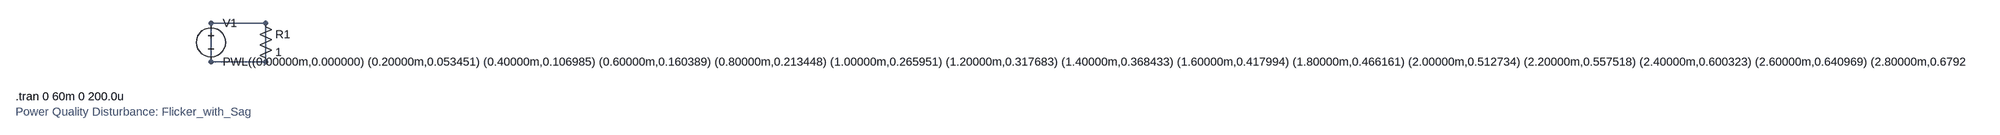
[diagram p0: schematic Flicker_with_Sag.asc]
Flicker_with_Sag.asc, the LTspice schematic file:
Version 4
SHEET 1 880 680
WIRE 192 128 80 128
WIRE 80 128 80 208
WIRE 192 208 80 208
WIRE 192 128 192 208
SYMBOL voltage 80 112 R0
WINDOW 123 0 0 Left 0
WINDOW 39 0 0 Left 0
SYMATTR InstName V1
SYMATTR Value PWL((0.00000m,0.000000) (0.20000m,0.053451) (0.40000m,0.106985) (0.60000m,0.160389) (0.80000m,0.213448) (1.00000m,0.265951) (1.20000m,0.317683) (1.40000m,0.368433) (1.60000m,0.417994) (1.80000m,0.466161) (2.00000m,0.512734) (2.20000m,0.557518) (2.40000m,0.600323) (2.60000m,0.640969) (2.80000m,0.679281) (3.00000m,0.715093) (3.20000m,0.748248) (3.40000m,0.778601) (3.60000m,0.806014) (3.80000m,0.830362) (4.00000m,0.851532) (4.20000m,0.869422) (4.40000m,0.883945) (4.60000m,0.895025) (4.80000m,0.902599) (5.00000m,0.906620) (5.20000m,0.907054) (5.40000m,0.903881) (5.60000m,0.897097) (5.80000m,0.886710) (6.00000m,0.872746) (6.20000m,0.855242) (6.40000m,0.834251) (6.60000m,0.809843) (6.80000m,0.782098) (7.00000m,0.751113) (7.20000m,0.716996) (7.40000m,0.679871) (7.60000m,0.639873) (7.80000m,0.597149) (8.00000m,0.551860) (8.20000m,0.504175) (8.40000m,0.454277) (8.60000m,0.402355) (8.80000m,0.348610) (9.00000m,0.293251) (9.20000m,0.236492) (9.40000m,0.178558) (9.60000m,0.119675) (9.80000m,0.060076) (10.00000m,0.000000) (10.20000m,-0.060315) (10.40000m,-0.120626) (10.60000m,-0.180692) (10.80000m,-0.240268) (11.00000m,-0.299114) (11.20000m,-0.356990) (11.40000m,-0.413658) (11.60000m,-0.468887) (11.80000m,-0.522449) (12.00000m,-0.574122) (12.20000m,-0.623690) (12.40000m,-0.670949) (12.60000m,-0.715697) (12.80000m,-0.757748) (13.00000m,-0.796922) (13.20000m,-0.833053) (13.40000m,-0.865984) (13.60000m,-0.895572) (13.80000m,-0.921689) (14.00000m,-0.944218) (14.20000m,-0.963056) (14.40000m,-0.978118) (14.60000m,-0.989330) (14.80000m,-0.996638) (15.00000m,-1.000000) (15.20000m,-0.999392) (15.40000m,-0.994804) (15.60000m,-0.986246) (15.80000m,-0.973741) (16.00000m,-0.957328) (16.20000m,-0.937066) (16.40000m,-0.913024) (16.60000m,-0.885293) (16.80000m,-0.853973) (17.00000m,-0.819184) (17.20000m,-0.781057) (17.40000m,-0.739740) (17.60000m,-0.695392) (17.80000m,-0.648184) (18.00000m,-0.598303) (18.20000m,-0.545943) (18.40000m,-0.491311) (18.60000m,-0.434623) (18.80000m,-0.376104) (19.00000m,-0.315986) (19.20000m,-0.254510) (19.40000m,-0.191921) (19.60000m,-0.128469) (19.80000m,-0.064410) (20.00000m,-0.000000) (20.20000m,0.032250) (20.40000m,0.064416) (20.60000m,0.096368) (20.80000m,0.127976) (21.00000m,0.159113) (21.20000m,0.189652) (21.40000m,0.219470) (21.60000m,0.248446) (21.80000m,0.276461) (22.00000m,0.303403) (22.20000m,0.329161) (22.40000m,0.353631) (22.60000m,0.376712) (22.80000m,0.398312) (23.00000m,0.418341) (23.20000m,0.436718) (23.40000m,0.453368) (23.60000m,0.468224) (23.80000m,0.481223) (24.00000m,0.492314) (24.20000m,0.501451) (24.40000m,0.508597) (24.60000m,0.513721) (24.80000m,0.516805) (25.00000m,0.517834) (25.20000m,0.516805) (25.40000m,0.513721) (25.60000m,0.508597) (25.80000m,0.501451) (26.00000m,0.492314) (26.20000m,0.481223) (26.40000m,0.468224) (26.60000m,0.453368) (26.80000m,0.436718) (27.00000m,0.418341) (27.20000m,0.398312) (27.40000m,0.376712) (27.60000m,0.353631) (27.80000m,0.329161) (28.00000m,0.303403) (28.20000m,0.276461) (28.40000m,0.248446) (28.60000m,0.219470) (28.80000m,0.189652) (29.00000m,0.159113) (29.20000m,0.127976) (29.40000m,0.096368) (29.60000m,0.064416) (29.80000m,0.032250) (30.00000m,0.000000) (30.20000m,-0.032205) (30.40000m,-0.064235) (30.60000m,-0.095960) (30.80000m,-0.127255) (31.00000m,-0.157993) (31.20000m,-0.188052) (31.40000m,-0.217311) (31.60000m,-0.245655) (31.80000m,-0.272971) (32.00000m,-0.299151) (32.20000m,-0.324092) (32.40000m,-0.347696) (32.60000m,-0.369870) (32.80000m,-0.390529) (33.00000m,-0.409592) (33.20000m,-0.426987) (33.40000m,-0.442646) (33.60000m,-0.456512) (33.80000m,-0.468533) (34.00000m,-0.478664) (34.20000m,-0.486870) (34.40000m,-0.493123) (34.60000m,-0.497402) (34.80000m,-0.499696) (35.00000m,-0.500000) (35.20000m,-0.498319) (35.40000m,-0.494665) (35.60000m,-0.489059) (35.80000m,-0.481528) (36.00000m,-0.472109) (36.20000m,-0.460845) (36.40000m,-0.447786) (36.60000m,-0.432992) (36.80000m,-0.416526) (37.00000m,-0.398461) (37.20000m,-0.378874) (37.40000m,-0.357849) (37.60000m,-0.335474) (37.80000m,-0.311845) (38.00000m,-0.287061) (38.20000m,-0.261224) (38.40000m,-0.234444) (38.60000m,-0.206829) (38.80000m,-0.178495) (39.00000m,-0.149557) (39.20000m,-0.120134) (39.40000m,-0.090346) (39.60000m,-0.060313) (39.80000m,-0.030157) (40.00000m,-0.000000) (40.20000m,0.060076) (40.40000m,0.119675) (40.60000m,0.178558) (40.80000m,0.236492) (41.00000m,0.293251) (41.20000m,0.348610) (41.40000m,0.402355) (41.60000m,0.454277) (41.80000m,0.504175) (42.00000m,0.551860) (42.20000m,0.597149) (42.40000m,0.639873) (42.60000m,0.679871) (42.80000m,0.716996) (43.00000m,0.751113) (43.20000m,0.782098) (43.40000m,0.809843) (43.60000m,0.834251) (43.80000m,0.855242) (44.00000m,0.872746) (44.20000m,0.886710) (44.40000m,0.897097) (44.60000m,0.903881) (44.80000m,0.907054) (45.00000m,0.906620) (45.20000m,0.902599) (45.40000m,0.895025) (45.60000m,0.883945) (45.80000m,0.869422) (46.00000m,0.851532) (46.20000m,0.830362) (46.40000m,0.806014) (46.60000m,0.778601) (46.80000m,0.748248) (47.00000m,0.715093) (47.20000m,0.679281) (47.40000m,0.640969) (47.60000m,0.600323) (47.80000m,0.557518) (48.00000m,0.512734) (48.20000m,0.466161) (48.40000m,0.417994) (48.60000m,0.368433) (48.80000m,0.317683) (49.00000m,0.265951) (49.20000m,0.213448) (49.40000m,0.160389) (49.60000m,0.106985) (49.80000m,0.053451) (50.00000m,0.000000) (50.20000m,-0.053156) (50.40000m,-0.105808) (50.60000m,-0.157751) (50.80000m,-0.208781) (51.00000m,-0.258703) (51.20000m,-0.307325) (51.40000m,-0.354462) (51.60000m,-0.399935) (51.80000m,-0.443574) (52.00000m,-0.485217) (52.20000m,-0.524711) (52.40000m,-0.561912) (52.60000m,-0.596686) (52.80000m,-0.628909) (53.00000m,-0.658469) (53.20000m,-0.685265) (53.40000m,-0.709207) (53.60000m,-0.730217) (53.80000m,-0.748228) (54.00000m,-0.763188) (54.20000m,-0.775054) (54.40000m,-0.783798) (54.60000m,-0.789404) (54.80000m,-0.791867) (55.00000m,-0.791196) (55.20000m,-0.787412) (55.40000m,-0.780547) (55.60000m,-0.770646) (55.80000m,-0.757766) (56.00000m,-0.741974) (56.20000m,-0.723348) (56.40000m,-0.701979) (56.60000m,-0.677965) (56.80000m,-0.651415) (57.00000m,-0.622449) (57.20000m,-0.591194) (57.40000m,-0.557784) (57.60000m,-0.522362) (57.80000m,-0.485079) (58.00000m,-0.446091) (58.20000m,-0.405560) (58.40000m,-0.363653) (58.60000m,-0.320540) (58.80000m,-0.276398) (59.00000m,-0.231403) (59.20000m,-0.185737) (59.40000m,-0.139581) (59.60000m,-0.093118) (59.80000m,-0.046530))
SYMBOL res 176 112 R0
SYMATTR InstName R1
SYMATTR Value 1
TEXT -320 280 Left 2 !.tran 0 60m 0 200.0u
TEXT -320 312 Left 2 ;Power Quality Disturbance: Flicker_with_Sag

The netlist it stands for:
* Flicker_with_Sag.asc
V1 N001 N001 PWL((0.00000m,0.000000) (0.20000m,0.053451) (0.40000m,0.106985) (0.60000m,0.160389) (0.80000m,0.213448) (1.00000m,0.265951) (1.20000m,0.317683) (1.40000m,0.368433) (1.60000m,0.417994) (1.80000m,0.466161) (2.00000m,0.512734) (2.20000m,0.557518) (2.40000m,0.600323) (2.60000m,0.640969) (2.80000m,0.679281) (3.00000m,0.715093) (3.20000m,0.748248) (3.40000m,0.778601) (3.60000m,0.806014) (3.80000m,0.830362) (4.00000m,0.851532) (4.20000m,0.869422) (4.40000m,0.883945) (4.60000m,0.895025) (4.80000m,0.902599) (5.00000m,0.906620) (5.20000m,0.907054) (5.40000m,0.903881) (5.60000m,0.897097) (5.80000m,0.886710) (6.00000m,0.872746) (6.20000m,0.855242) (6.40000m,0.834251) (6.60000m,0.809843) (6.80000m,0.782098) (7.00000m,0.751113) (7.20000m,0.716996) (7.40000m,0.679871) (7.60000m,0.639873) (7.80000m,0.597149) (8.00000m,0.551860) (8.20000m,0.504175) (8.40000m,0.454277) (8.60000m,0.402355) (8.80000m,0.348610) (9.00000m,0.293251) (9.20000m,0.236492) (9.40000m,0.178558) (9.60000m,0.119675) (9.80000m,0.060076) (10.00000m,0.000000) (10.20000m,-0.060315) (10.40000m,-0.120626) (10.60000m,-0.180692) (10.80000m,-0.240268) (11.00000m,-0.299114) (11.20000m,-0.356990) (11.40000m,-0.413658) (11.60000m,-0.468887) (11.80000m,-0.522449) (12.00000m,-0.574122) (12.20000m,-0.623690) (12.40000m,-0.670949) (12.60000m,-0.715697) (12.80000m,-0.757748) (13.00000m,-0.796922) (13.20000m,-0.833053) (13.40000m,-0.865984) (13.60000m,-0.895572) (13.80000m,-0.921689) (14.00000m,-0.944218) (14.20000m,-0.963056) (14.40000m,-0.978118) (14.60000m,-0.989330) (14.80000m,-0.996638) (15.00000m,-1.000000) (15.20000m,-0.999392) (15.40000m,-0.994804) (15.60000m,-0.986246) (15.80000m,-0.973741) (16.00000m,-0.957328) (16.20000m,-0.937066) (16.40000m,-0.913024) (16.60000m,-0.885293) (16.80000m,-0.853973) (17.00000m,-0.819184) (17.20000m,-0.781057) (17.40000m,-0.739740) (17.60000m,-0.695392) (17.80000m,-0.648184) (18.00000m,-0.598303) (18.20000m,-0.545943) (18.40000m,-0.491311) (18.60000m,-0.434623) (18.80000m,-0.376104) (19.00000m,-0.315986) (19.20000m,-0.254510) (19.40000m,-0.191921) (19.60000m,-0.128469) (19.80000m,-0.064410) (20.00000m,-0.000000) (20.20000m,0.032250) (20.40000m,0.064416) (20.60000m,0.096368) (20.80000m,0.127976) (21.00000m,0.159113) (21.20000m,0.189652) (21.40000m,0.219470) (21.60000m,0.248446) (21.80000m,0.276461) (22.00000m,0.303403) (22.20000m,0.329161) (22.40000m,0.353631) (22.60000m,0.376712) (22.80000m,0.398312) (23.00000m,0.418341) (23.20000m,0.436718) (23.40000m,0.453368) (23.60000m,0.468224) (23.80000m,0.481223) (24.00000m,0.492314) (24.20000m,0.501451) (24.40000m,0.508597) (24.60000m,0.513721) (24.80000m,0.516805) (25.00000m,0.517834) (25.20000m,0.516805) (25.40000m,0.513721) (25.60000m,0.508597) (25.80000m,0.501451) (26.00000m,0.492314) (26.20000m,0.481223) (26.40000m,0.468224) (26.60000m,0.453368) (26.80000m,0.436718) (27.00000m,0.418341) (27.20000m,0.398312) (27.40000m,0.376712) (27.60000m,0.353631) (27.80000m,0.329161) (28.00000m,0.303403) (28.20000m,0.276461) (28.40000m,0.248446) (28.60000m,0.219470) (28.80000m,0.189652) (29.00000m,0.159113) (29.20000m,0.127976) (29.40000m,0.096368) (29.60000m,0.064416) (29.80000m,0.032250) (30.00000m,0.000000) (30.20000m,-0.032205) (30.40000m,-0.064235) (30.60000m,-0.095960) (30.80000m,-0.127255) (31.00000m,-0.157993) (31.20000m,-0.188052) (31.40000m,-0.217311) (31.60000m,-0.245655) (31.80000m,-0.272971) (32.00000m,-0.299151) (32.20000m,-0.324092) (32.40000m,-0.347696) (32.60000m,-0.369870) (32.80000m,-0.390529) (33.00000m,-0.409592) (33.20000m,-0.426987) (33.40000m,-0.442646) (33.60000m,-0.456512) (33.80000m,-0.468533) (34.00000m,-0.478664) (34.20000m,-0.486870) (34.40000m,-0.493123) (34.60000m,-0.497402) (34.80000m,-0.499696) (35.00000m,-0.500000) (35.20000m,-0.498319) (35.40000m,-0.494665) (35.60000m,-0.489059) (35.80000m,-0.481528) (36.00000m,-0.472109) (36.20000m,-0.460845) (36.40000m,-0.447786) (36.60000m,-0.432992) (36.80000m,-0.416526) (37.00000m,-0.398461) (37.20000m,-0.378874) (37.40000m,-0.357849) (37.60000m,-0.335474) (37.80000m,-0.311845) (38.00000m,-0.287061) (38.20000m,-0.261224) (38.40000m,-0.234444) (38.60000m,-0.206829) (38.80000m,-0.178495) (39.00000m,-0.149557) (39.20000m,-0.120134) (39.40000m,-0.090346) (39.60000m,-0.060313) (39.80000m,-0.030157) (40.00000m,-0.000000) (40.20000m,0.060076) (40.40000m,0.119675) (40.60000m,0.178558) (40.80000m,0.236492) (41.00000m,0.293251) (41.20000m,0.348610) (41.40000m,0.402355) (41.60000m,0.454277) (41.80000m,0.504175) (42.00000m,0.551860) (42.20000m,0.597149) (42.40000m,0.639873) (42.60000m,0.679871) (42.80000m,0.716996) (43.00000m,0.751113) (43.20000m,0.782098) (43.40000m,0.809843) (43.60000m,0.834251) (43.80000m,0.855242) (44.00000m,0.872746) (44.20000m,0.886710) (44.40000m,0.897097) (44.60000m,0.903881) (44.80000m,0.907054) (45.00000m,0.906620) (45.20000m,0.902599) (45.40000m,0.895025) (45.60000m,0.883945) (45.80000m,0.869422) (46.00000m,0.851532) (46.20000m,0.830362) (46.40000m,0.806014) (46.60000m,0.778601) (46.80000m,0.748248) (47.00000m,0.715093) (47.20000m,0.679281) (47.40000m,0.640969) (47.60000m,0.600323) (47.80000m,0.557518) (48.00000m,0.512734) (48.20000m,0.466161) (48.40000m,0.417994) (48.60000m,0.368433) (48.80000m,0.317683) (49.00000m,0.265951) (49.20000m,0.213448) (49.40000m,0.160389) (49.60000m,0.106985) (49.80000m,0.053451) (50.00000m,0.000000) (50.20000m,-0.053156) (50.40000m,-0.105808) (50.60000m,-0.157751) (50.80000m,-0.208781) (51.00000m,-0.258703) (51.20000m,-0.307325) (51.40000m,-0.354462) (51.60000m,-0.399935) (51.80000m,-0.443574) (52.00000m,-0.485217) (52.20000m,-0.524711) (52.40000m,-0.561912) (52.60000m,-0.596686) (52.80000m,-0.628909) (53.00000m,-0.658469) (53.20000m,-0.685265) (53.40000m,-0.709207) (53.60000m,-0.730217) (53.80000m,-0.748228) (54.00000m,-0.763188) (54.20000m,-0.775054) (54.40000m,-0.783798) (54.60000m,-0.789404) (54.80000m,-0.791867) (55.00000m,-0.791196) (55.20000m,-0.787412) (55.40000m,-0.780547) (55.60000m,-0.770646) (55.80000m,-0.757766) (56.00000m,-0.741974) (56.20000m,-0.723348) (56.40000m,-0.701979) (56.60000m,-0.677965) (56.80000m,-0.651415) (57.00000m,-0.622449) (57.20000m,-0.591194) (57.40000m,-0.557784) (57.60000m,-0.522362) (57.80000m,-0.485079) (58.00000m,-0.446091) (58.20000m,-0.405560) (58.40000m,-0.363653) (58.60000m,-0.320540) (58.80000m,-0.276398) (59.00000m,-0.231403) (59.20000m,-0.185737) (59.40000m,-0.139581) (59.60000m,-0.093118) (59.80000m,-0.046530))
R1 N001 N001 1
.tran 0 60m 0 200.0u
* Power Quality Disturbance: Flicker_with_Sag
.backanno
.end